# EAGLE schematic MemcalLong_27C (EAGLE 9.6.2)
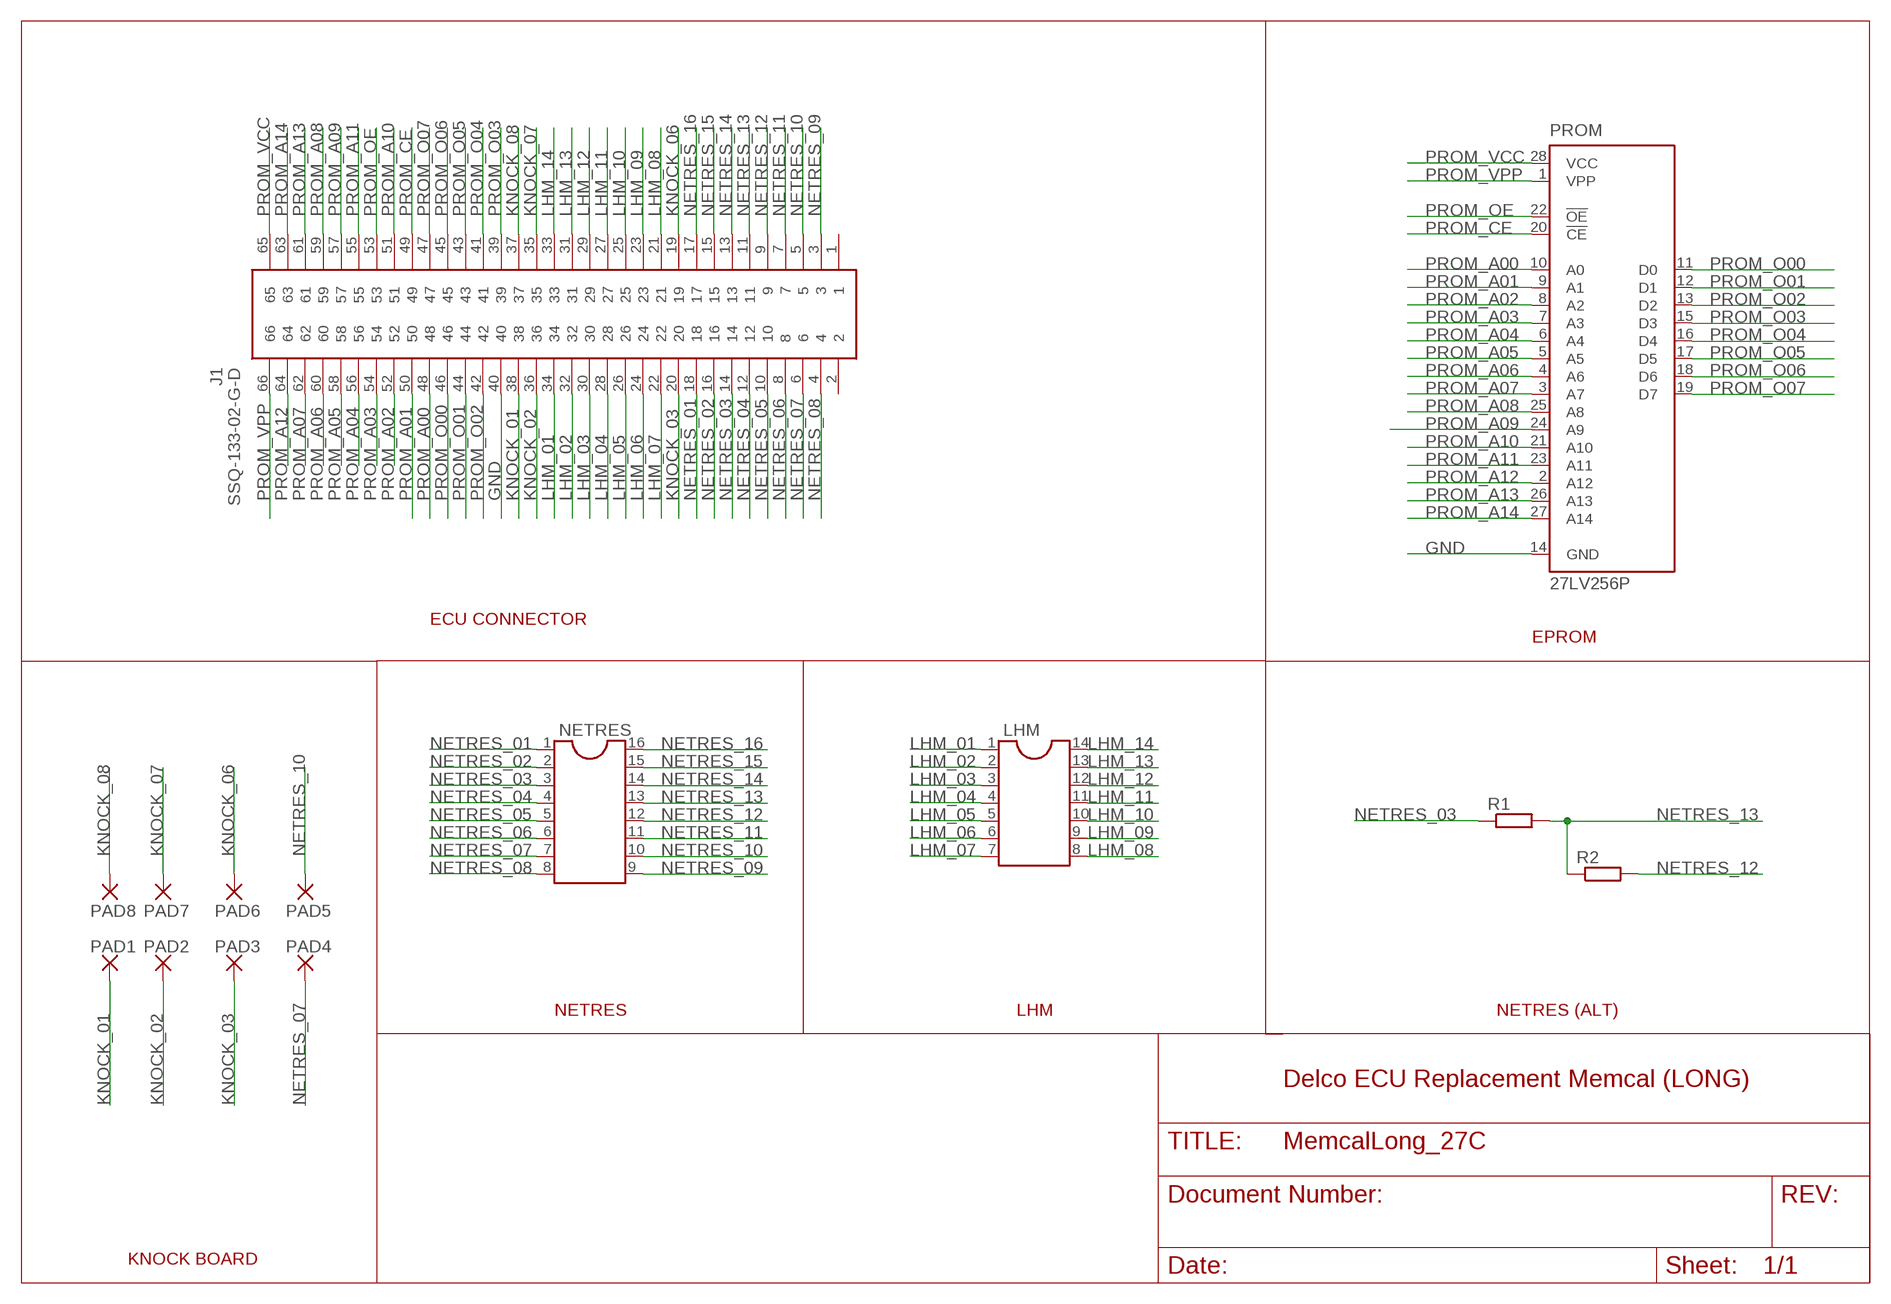
[diagram p0: schematic, sheet 1]

## Parts
J1  SSQ-133-02-G-D  [SSQ-133-XX-YYY]
LHM  DIL14S  [SOCKET-14]
NETRES  DIL16S  [SOCKET-16]
PAD1  SMD2  [SMD1,27-2,54]
PAD2  SMD2  [SMD1,27-2,54]
PAD3  SMD2  [SMD1,27-2,54]
PAD4  SMD2  [SMD1,27-2,54]
PAD5  SMD2  [SMD1,27-2,54]
PAD6  SMD2  [SMD1,27-2,54]
PAD7  SMD2  [SMD1,27-2,54]
PAD8  SMD2  [SMD1,27-2,54]
PROM  27LV256P  [DIL28-6]
R1  R-EU_0204/7  [0204/7]
R2  R-EU_0204/7  [0204/7]

## Nets
GND: J1.40 PROM.14(GND)
KNOCK_01: J1.38 PAD1.1(P)
KNOCK_02: J1.36 PAD2.1(P)
KNOCK_03: J1.20 PAD3.1(P)
KNOCK_06: J1.19 PAD6.1(P)
KNOCK_07: J1.35 PAD7.1(P)
KNOCK_08: J1.37 PAD8.1(P)
LHM_01: J1.34 LHM.1
LHM_02: J1.32 LHM.2
LHM_03: J1.30 LHM.3
LHM_04: J1.28 LHM.4
LHM_05: J1.26 LHM.5
LHM_06: J1.24 LHM.6
LHM_07: J1.22 LHM.7
LHM_08: J1.21 LHM.8
LHM_09: J1.23 LHM.9
LHM_10: J1.25 LHM.10
LHM_11: J1.27 LHM.11
LHM_12: J1.29 LHM.12
LHM_13: J1.31 LHM.13
LHM_14: J1.33 LHM.14
NETRES_01: J1.18 NETRES.1
NETRES_02: J1.16 NETRES.2
NETRES_03: J1.14 NETRES.3 R1.1
NETRES_04: J1.12 NETRES.4
NETRES_05: J1.10 NETRES.5
NETRES_06: J1.8 NETRES.6
NETRES_07: J1.6 NETRES.7 PAD4.1(P)
NETRES_08: J1.4 NETRES.8
NETRES_09: J1.3 NETRES.9
NETRES_10: J1.5 NETRES.10 PAD5.1(P)
NETRES_11: J1.7 NETRES.11
NETRES_12: J1.9 NETRES.12 R2.2
NETRES_13: J1.11 NETRES.13 R1.2 R2.1
NETRES_14: J1.13 NETRES.14
NETRES_15: J1.15 NETRES.15
NETRES_16: J1.17 NETRES.16
PROM_A00: J1.48 PROM.10(A0)
PROM_A01: J1.50 PROM.9(A1)
PROM_A02: J1.52 PROM.8(A2)
PROM_A03: J1.54 PROM.7(A3)
PROM_A04: J1.56 PROM.6(A4)
PROM_A05: J1.58 PROM.5(A5)
PROM_A06: J1.60 PROM.4(A6)
PROM_A07: J1.62 PROM.3(A7)
PROM_A08: J1.59 PROM.25(A8)
PROM_A09: J1.57 PROM.24(A9)
PROM_A10: J1.51 PROM.21(A10)
PROM_A11: J1.55 PROM.23(A11)
PROM_A12: J1.64 PROM.2(A12)
PROM_A13: J1.61 PROM.26(A13)
PROM_A14: J1.63 PROM.27(A14)
PROM_CE: J1.49 PROM.20(!CE)
PROM_O00: J1.46 PROM.11(D0)
PROM_O01: J1.44 PROM.12(D1)
PROM_O02: J1.42 PROM.13(D2)
PROM_O03: J1.39 PROM.15(D3)
PROM_O04: J1.41 PROM.16(D4)
PROM_O05: J1.43 PROM.17(D5)
PROM_O06: J1.45 PROM.18(D6)
PROM_O07: J1.47 PROM.19(D7)
PROM_OE: J1.53 PROM.22(!OE)
PROM_VCC: J1.65 PROM.28(VCC)
PROM_VPP: J1.66 PROM.1(VPP)
Unconnected: J1.1 J1.2

## Notes on the sheet
- ECU CONNECTOR
- EPROM
- NETRES | LHM | NETRES (ALT)
- Delco ECU Replacement Memcal (LONG)
- KNOCK BOARD

## Library data of the parts
J1 = SSQ-133-02-G-D:SSQ-133-02-G-D: 66 Position, .100" Tiger Buy™ Socket Strip, Square Tail Source: Datasheet <http://suddendocs.samtec.com/prints/ssq-1xx-xx-xxx-x-xx-xxx-xx-x-mkt.pdf>; DESCRIPTION: 66 Position, .100&quot; Tiger Buy&trade; Socket Strip, Square Tail; HEIGHT: mm; MANUFACTURER_NAME: SAMTEC; MANUFACTURER_PART_NUMBER: SSQ-133-02-G-D
LHM = ic-package:DIL14: Dual In Line / Socket
NETRES = ic-package:DIL16: Dual In Line / Socket
PAD1-PAD8 = wirepad:SMD2: SMD PAD
PROM = microchip:27*256: CMOS EPROM 256 K (32 K x 8), low voltage; OC_FARNELL: unknown; OC_NEWARK: unknown
R1 R2 = rcl:R-EU_: RESISTOR, European symbol; SPICEPREFIX: R